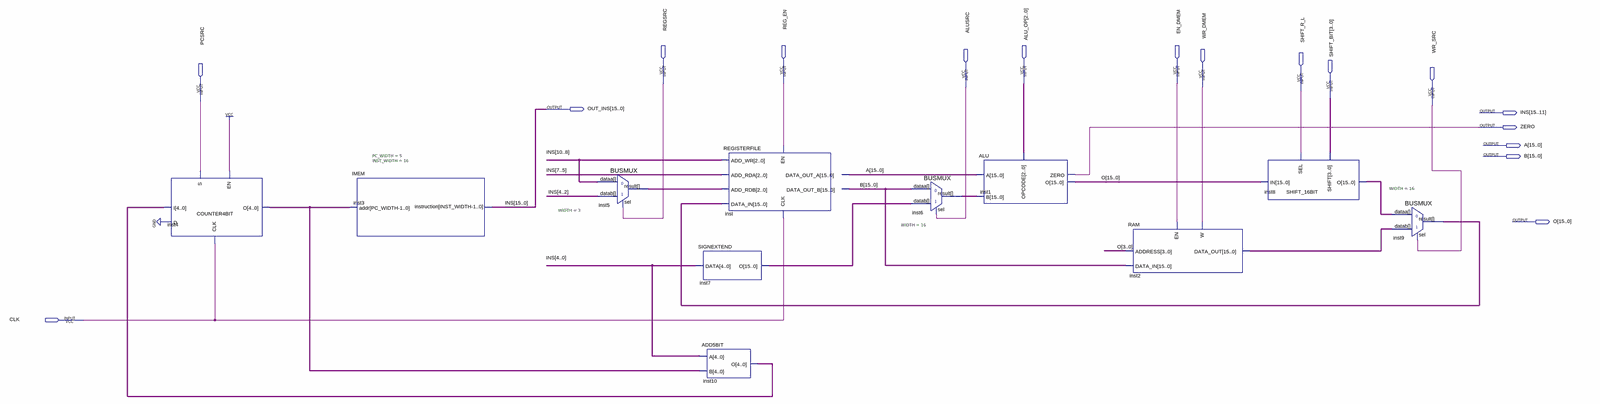
[diagram p0: schematic sheet, whole]
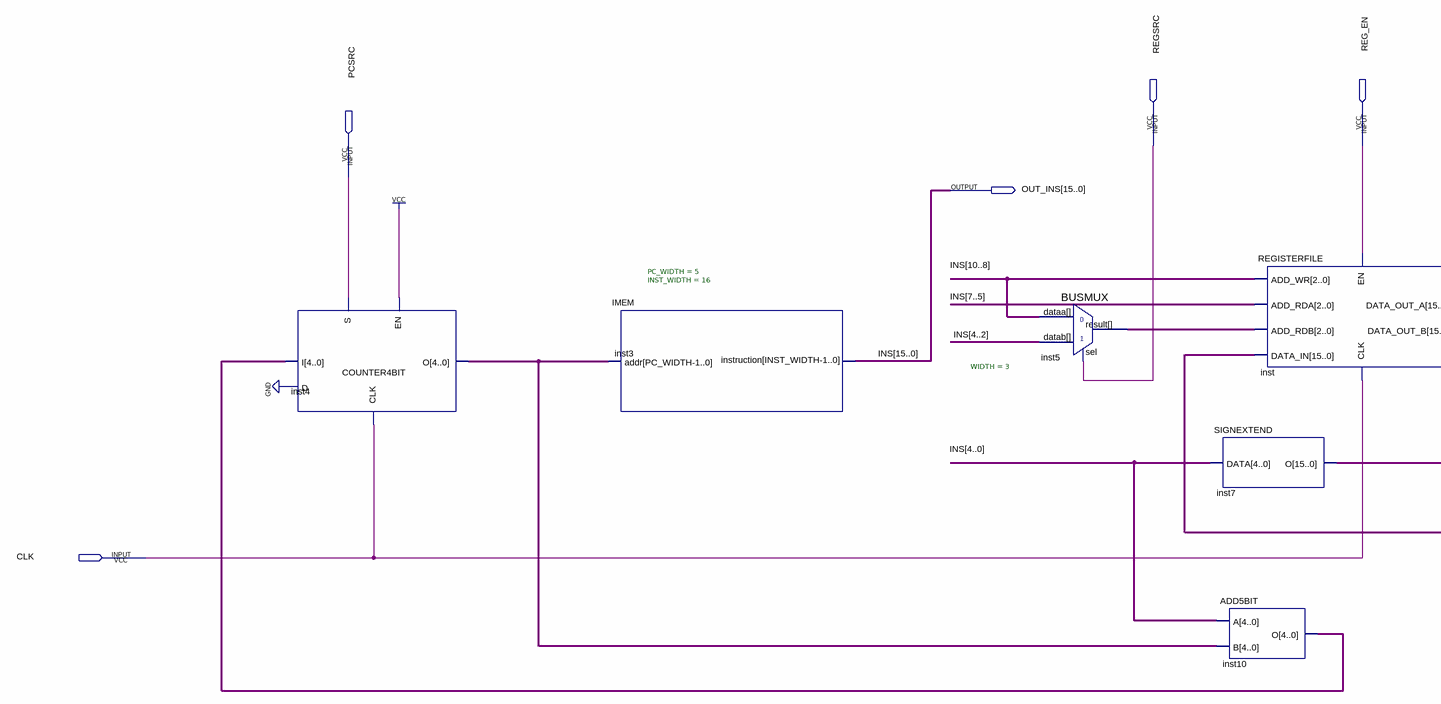
[diagram p1: schematic sheet, left part]
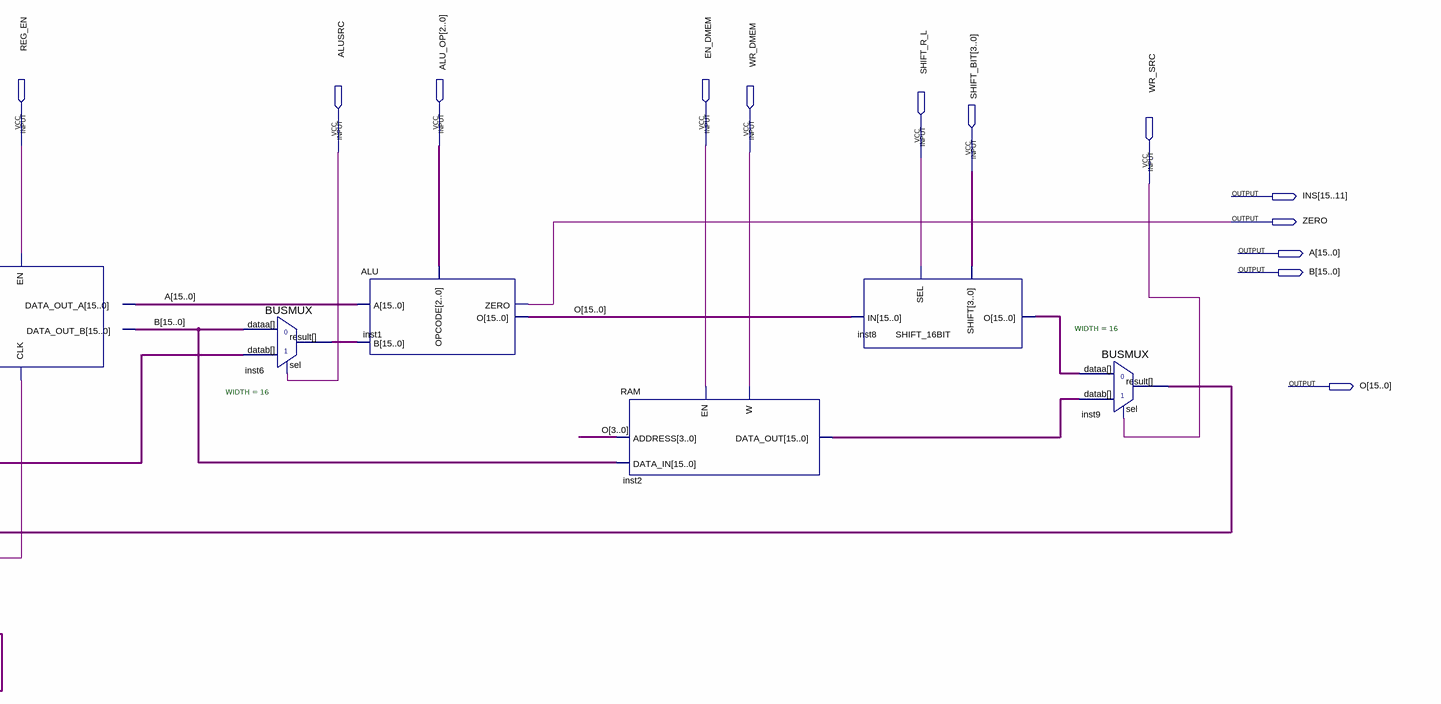
[diagram p2: schematic sheet, right part]
// Quartus schematic DATAPATH.bdf as structural Verilog: 11 symbols, 17 pins
module DATAPATH (
  input  REGSRC,
  input  REG_EN,
  input  [2:0] ALU_OP,
  input  EN_DMEM,
  input  ALUSRC,
  input  WR_DMEM,
  input  SHIFT_R_L,
  input  [3:0] SHIFT_BIT,
  input  PCSRC,
  input  WR_SRC,
  input  CLK,
  output [15:0] OUT_INS,
  output [15:11] INS,
  output ZERO,
  output [15:0] A,
  output [15:0] B,
  output [15:0] O
);

  wire [2:0] inst5_result;
  wire [4:0] inst4_o, inst10_o;
  wire [15:0] inst2_data_out, inst6_result, inst7_o, inst8_o, inst9_result;

  COUNTER4BIT inst4 (.I(inst10_o), .S(PCSRC), .EN(1'b1), .D(1'b0), .CLK(CLK), .O(inst4_o));
  IMEM #(.PC_WIDTH(5), .INST_WIDTH(16)) inst3 (.addr(inst4_o), .instruction({INS, OUT_INS[10:0]}));
  BUSMUX #(.WIDTH(3)) inst5 (.datab(OUT_INS[4:2]), .sel(REGSRC), .dataa(OUT_INS[10:8]), .result(inst5_result));
  SIGNEXTEND inst7 (.DATA(OUT_INS[4:0]), .O(inst7_o));
  ADD5BIT inst10 (.A(OUT_INS[4:0]), .B(inst4_o), .O(inst10_o));
  REGISTERFILE inst (
    .DATA_IN(inst9_result), .ADD_RDA(OUT_INS[7:5]), .ADD_RDB(inst5_result), .ADD_WR(OUT_INS[10:8]),
    .EN(REG_EN), .CLK(CLK), .DATA_OUT_A(A), .DATA_OUT_B(B));
  BUSMUX #(.WIDTH(16)) inst6 (.datab(inst7_o), .sel(ALUSRC), .dataa(B), .result(inst6_result));
  ALU inst1 (.OPCODE(ALU_OP), .A(A), .B(inst6_result), .O(O), .ZERO(ZERO));
  RAM inst2 (.DATA_IN(B), .W(WR_DMEM), .ADDRESS(O[3:0]), .EN(EN_DMEM), .DATA_OUT(inst2_data_out));
  SHIFT_16BIT inst8 (.SEL(SHIFT_R_L), .SHIFT(SHIFT_BIT), .IN(O), .O(inst8_o));
  BUSMUX #(.WIDTH(16)) inst9 (.datab(inst2_data_out), .sel(WR_SRC), .dataa(inst8_o), .result(inst9_result));

  assign OUT_INS[15:11] = INS;

  // Other names for the same wires on the sheet: INS[10:0] = OUT_INS[10:0]
endmodule
